# EAGLE design Tesseract_BLDC_Vero (12x12) (EAGLE 7.7.0)

## Sheet 1 of 2

## Sheet 2 of 2
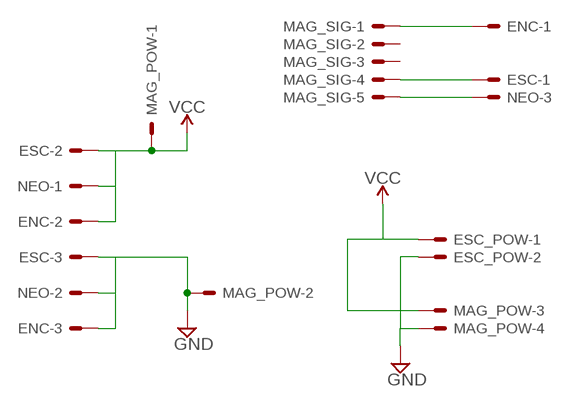
[diagram p0: schematic, sheet 2]

### Parts
ENC  JST-XH-03-PIN-LONG-PAD  [JST-XH-03-PACKAGE-LONG-PAD]
ESC  JST-XH-03-PIN-LONG-PAD  [JST-XH-03-PACKAGE-LONG-PAD]
ESC_POW  JST-XH-02-PIN-LONG-PAD  [JST-XH-02-PACKAGE-LONG-PAD]
MAG_POW  JST-XH-04-PIN-LONG-PAD  [JST-XH-04-PACKAGE-LONG-PAD]
MAG_SIG  JST-XH-05-PIN-LONG-PAD  [JST-XH-05-PACKAGE-LONG-PAD]
NEO  JST-XH-03-PIN-LONG-PAD  [JST-XH-03-PACKAGE-LONG-PAD]

### Nets
5V_GND: ENC.3 ESC.3 MAG_POW.2 NEO.2 ; supply symbol labelled GND
5V_VCC: ENC.2 ESC.2 MAG_POW.1 NEO.1 ; supply symbol labelled VCC
12V_GND: ESC_POW.2 MAG_POW.4 ; supply symbol labelled GND
12V_VCC: ESC_POW.1 MAG_POW.3 ; supply symbol labelled VCC
PIN3: ENC.1 MAG_SIG.1
PIN6: ESC.1 MAG_SIG.4
PIN7: MAG_SIG.5 NEO.3
Unconnected: MAG_SIG.2 MAG_SIG.3

## Library data of the parts
ENC ESC NEO = Rembrandt Electronics - JST XH Connectors v1-0:JST-XH-03-PIN: JST XH Connector 2 Pin Wire to board connector. Pitch: 2,54 mm, (0.100") Number of pins: 3 Created by Rembrandt Electronics www.rembrandtelectronics.com
ESC_POW = Rembrandt Electronics - JST XH Connectors v1-0:JST-XH-02-PIN: JST XH Connector 2 Pin Wire to board connector. Pitch: 2,54 mm, (0.100") Number of pins: 2 Created by Rembrandt Electronics www.rembrandtelectronics.com
MAG_POW = Rembrandt Electronics - JST XH Connectors v1-0:JST-XH-04-PIN: JST XH Connector 2 Pin Wire to board connector. Pitch: 2,54 mm, (0.100") Number of pins: 4 Created by Rembrandt Electronics www.rembrandtelectronics.com
MAG_SIG = Rembrandt Electronics - JST XH Connectors v1-0:JST-XH-05-PIN: JST XH Connector 2 Pin Wire to board connector. Pitch: 2,54 mm, (0.100") Number of pins: 5 Created by Rembrandt Electronics www.rembrandtelectronics.com

## Board
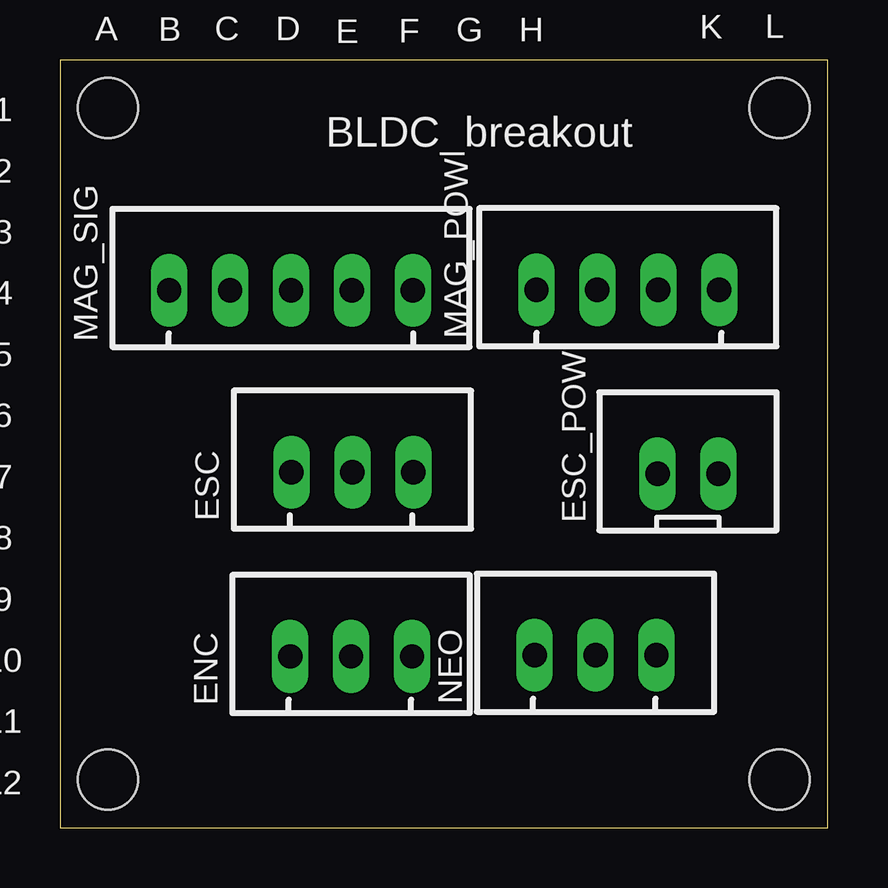
[diagram p1: board, top side]
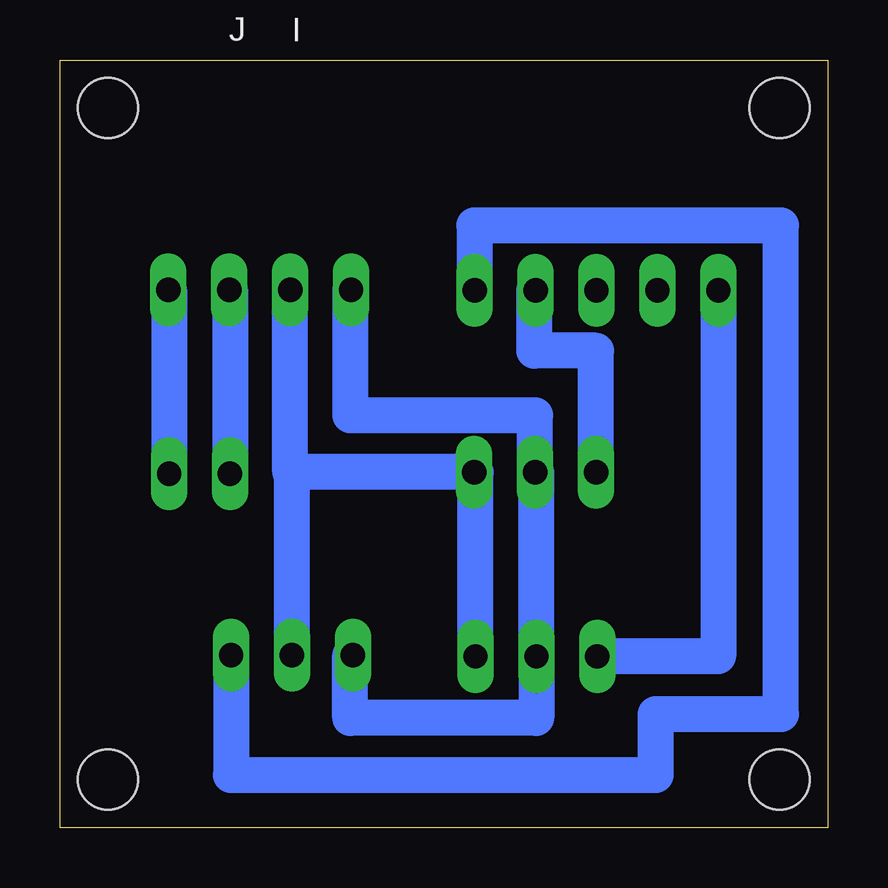
[diagram p2: board, bottom side, seen from below]

Size 32 x 32 mm. Coordinates in mm from the lower left corner, seen from the top.
Outline: 0,0 32,0 32,32 0,32 0,0
Copper layers (1*16): Top 0.035mm / dielectric 1.5mm / Bottom 0.035mm
Design rules "default": minimum track width 10mil, minimum drill 24mil, track to track 8mil, track to pad 8mil, pad to pad 8mil, via to via 8mil, smd to smd 8mil, copper to edge 40mil, drill to drill 8mil, minimum pad ring 10mil, minimum via ring 8mil, stop-mask expansion 4mil, vias tented up to drill 0mil, thermal gap 10mil
Holes 2.5 mm at 30,2 2,2 30,30 2,30

### Footprints (pad centres in the part's own frame; a part is rotated, then mirrored left to right if it is on the bottom)
JST-XH-03-PACKAGE-LONG-PAD = drill 1.016 long: 1 -2.54,0; 2 0,0; 3 2.54,0
JST-XH-02-PACKAGE-LONG-PAD = drill 1.016 long: 1 -1.27,0; 2 1.27,0
JST-XH-04-PACKAGE-LONG-PAD = drill 1.016 long: 1 -3.81,0; 2 -1.27,0; 3 1.27,0; 4 3.81,0
JST-XH-05-PACKAGE-LONG-PAD = drill 1.016 long: 1 -5.08,0; 2 -2.54,0; 3 0,0; 4 2.54,0; 5 5.08,0

### Placement (x,y rotation side)
ENC  12.14,7.14 0 top
ESC  12.19,14.82 0 top
ESC_POW  26.18,14.74 0 top
MAG_POW  23.67,22.42 0 top
MAG_SIG  9.63,22.4 0 top
NEO  22.33,7.18 0 top
U$15  [12X12]  16,30 0 top

### Tracks (layer width: path | path; a pad name or v marks a point on that pad's centre or on a via)
5V_GND
  Bottom 0.406: 14.68,14.82 ESC.3 | 22.33,14.82 22.4,14.82
  Bottom 1.5: ESC.3 22.33,14.82 NEO.2 | 22.4,14.82 MAG_POW.2 | ENC.3 14.68,14.82
5V_VCC
  Bottom 0.406: 19.89,22.42 MAG_POW.1 | 12.14,14.82 ESC.2 | 19.9,7.18 NEO.1
  Bottom 1.5: ESC.2 12.19,17.18 19.89,17.18 19.89,22.42 | 12.14,14.82 ENC.2 12.14,4.57 19.9,4.57 19.9,7.18
12V_GND
  Bottom 0.406: MAG_POW.4 27.45,22.42
  Bottom 1.5: 27.45,22.42 ESC_POW.2
12V_VCC
  Bottom 0.406: MAG_POW.3 24.91,22.42
  Bottom 1.5: 24.91,22.42 ESC_POW.1
PIN3
  Bottom 1.5: MAG_SIG.1 4.55,7.14 ENC.1
PIN6
  Bottom 0.406: 12.23,22.4 MAG_SIG.4
  Bottom 1.5: ESC.1 9.65,19.88 12.23,19.88 12.23,22.4
PIN7
  Bottom 0.406: 14.72,22.4 MAG_SIG.5
  Bottom 1.5: NEO.3 24.87,2.19 7.16,2.19 7.16,4.73 1.94,4.73 1.94,25.1 14.72,25.1 14.72,22.4

### Text on the board
tPlace: A | B | C | D | E | F | G | H | K | L | 1 / 2 / 3 / 4 / 5 / 6 / 7 / 8 / 9 / 10 / 11 / 12
bPlace: I | J
tNames: BLDC_breakout